# EAGLE design sms_gw (EAGLE 7.5.0)
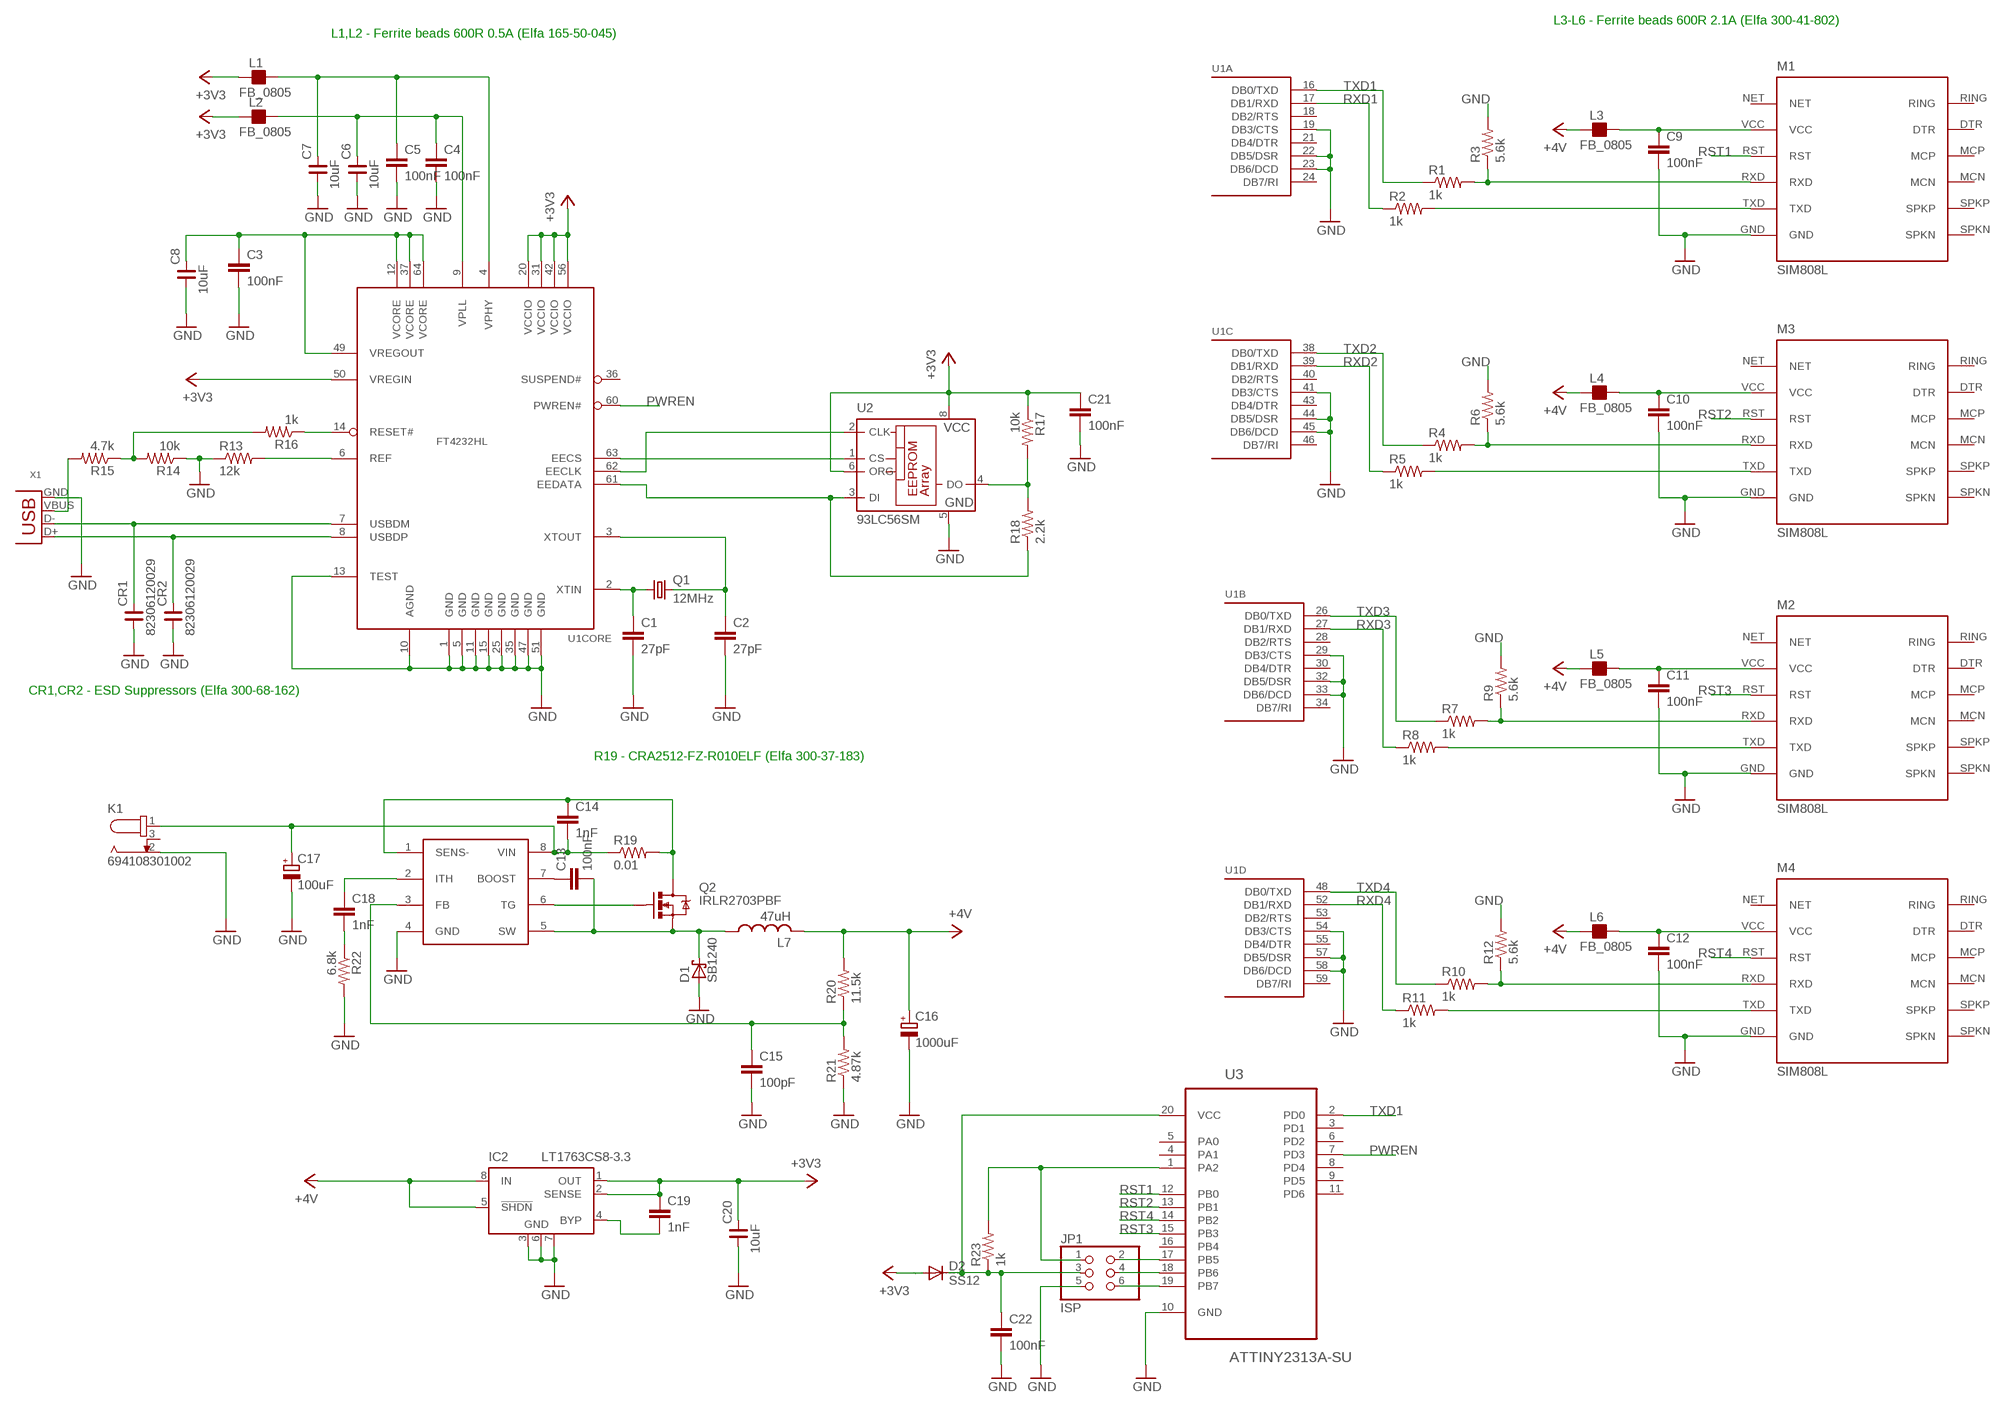
[diagram p0: schematic, sheet 1]

## Parts
C1  27pF  C-EUC0805  [C0805]
C2  27pF  C-EUC0805  [C0805]
C3  100nF  C-EUC0805  [C0805]
C4  100nF  C-EUC0805  [C0805]
C5  100nF  C-EUC0805  [C0805]
C6  10uF  C_1210  [C1210]
C7  10uF  C_1210  [C1210]
C8  10uF  C_1210  [C1210]
C9  100nF  C-EUC0805  [C0805]
C10  100nF  C-EUC0805  [C0805]
C11  100nF  C-EUC0805  [C0805]
C12  100nF  C-EUC0805  [C0805]
C13  100nF  C-EUC1206  [C1206]
C14  1nF  C-EUC0805  [C0805]
C15  100pF  C-EUC0805  [C0805]
C16  1000uF  CPOL-EUE5-8.5  [E5-8,5]
C17  100uF  CPOL-EUE5-8.5  [E5-8,5]
C18  1nF  C-EUC0805  [C0805]
C19  1nF  C-EUC0805  [C0805]
C20  10uF  C_1210  [C1210]
C21  100nF  C-EUC0805  [C0805]
C22  100nF  C-EUC0805  [C0805]
CR1  82306120029  C_0603  [C0603]
CR2  82306120029  C_0603  [C0603]
D1  SB1240  SCHOTTKY-DIODEF126Z12  [F126Z12]
D2  SS12  DIODE-DO-214AC  [DO-214AC]
IC1  LTC1624S8  [SO08]
IC2  LT1763CS8-3.3  [SOIC8]
JP1  ISP  PINHD-2X3  [2X03]
K1  694108301002  [694108301002]
L1  FB_0805  [L0805]
L2  FB_0805  [L0805]
L3  FB_0805  [L0805]
L4  FB_0805  [L0805]
L5  FB_0805  [L0805]
L6  FB_0805  [L0805]
L7  47uH  L-USTJ3-U2  [TJ3-U2]
M1  SIM808L  [SIM800L]
M2  SIM808L  [SIM800L]
M3  SIM808L  [SIM800L]
M4  SIM808L  [SIM800L]
Q1  12MHz  CRYSTALHC49U-V  [HC49U-V]
Q2  IRLR2703PBF  MOSFET-NCHANNELFDD8780  [DPAK]
R1  1k  R-US_R0805  [R0805]
R2  1k  R-US_R0805  [R0805]
R3  5.6k  R-US_R0805  [R0805]
R4  1k  R-US_R0805  [R0805]
R5  1k  R-US_R0805  [R0805]
R6  5.6k  R-US_R0805  [R0805]
R7  1k  R-US_R0805  [R0805]
R8  1k  R-US_R0805  [R0805]
R9  5.6k  R-US_R0805  [R0805]
R10  1k  R-US_R0805  [R0805]
R11  1k  R-US_R0805  [R0805]
R12  5.6k  R-US_R0805  [R0805]
R13  12k  R-US_R0805  [R0805]
R14  10k  R-US_R0805  [R0805]
R15  4.7k  R-US_R0805  [R0805]
R16  1k  R-US_R0805  [R0805]
R17  10k  R-US_R0805  [R0805]
R18  2.2k  R-US_R0805  [R0805]
R19  0.01  R-US_R2512  [R2512]
R20  11.5k  R-US_R0603  [R0603]
R21  4.87k  R-US_R0603  [R0603]
R22  6.8k  R-US_R0805  [R0805]
R23  1k  R-US_R0805  [R0805]
U1  FT4232HL  [LQFP64]
U2  93LC56SM  [SO-08M]
U3  ATTINY2313A-SU  [SOIC127P1032X265-20N]
X1  USB-B-H  [USB-B-H]

## Nets
+1V8: C3.1 C8.2 U1.12(CORE:VCORE) U1.37(CORE:VCORE) U1.49(CORE:VREGOUT) U1.64(CORE:VCORE)
+3V3: C19.1 C20.2 C21.1 D2.A IC2.1(OUT) IC2.2(SENSE) L1.1 L2.1 R17.1 U1.20(CORE:VCCIO) U1.31(CORE:VCCIO) U1.42(CORE:VCCIO) U1.50(CORE:VREGIN) U1.56(CORE:VCCIO) U2.6(ORG) U2.8(VCC)
+4V: C16.+ IC2.5(!SHDN) IC2.8(IN) L3.1 L4.1 L5.1 L6.1 L7.2 R20.2
GND: C1.2 C2.2 C3.2 C4.2 C5.2 C6.1 C7.1 C8.1 C9.2 C10.2 C11.2 C12.2 C15.2 C16.- C17.- C20.1 C21.2 C22.2 CR1.1 CR2.1 D1.A IC1.4(GND) IC2.3(GND) IC2.6(GND) IC2.7(GND) JP1.5 K1.2 M1.GND M2.GND M3.GND M4.GND R3.2 R6.2 R9.2 R12.2 R13.1 R14.1 R21.1 R22.2 U1.1(CORE:GND) U1.5(CORE:GND) U1.10(CORE:AGND) U1.11(CORE:GND) U1.13(CORE:TEST) U1.15(CORE:GND) U1.19(A:DB3/CTS) U1.22(A:DB5/DSR) U1.23(A:DB6/DCD) U1.25(CORE:GND) U1.29(B:DB3/CTS) U1.32(B:DB5/DSR) U1.33(B:DB6/DCD) U1.35(CORE:GND) U1.41(C:DB3/CTS) U1.44(C:DB5/DSR) U1.45(C:DB6/DCD) U1.47(CORE:GND) U1.51(CORE:GND) U1.54(D:DB3/CTS) U1.57(D:DB5/DSR) U1.58(D:DB6/DCD) U2.5(GND) U3.10(GND) X1.GND
N$1: M3.TXD R5.2
N$2: M1.TXD R2.2
N$5: M1.RXD R1.2 R3.1
N$7: JP1.2 U3.17(PB5)
N$8: M3.RXD R4.2 R6.1
N$9: M2.TXD R8.2
N$12: M2.RXD R7.2 R9.1
N$13: M4.TXD R11.2
N$14: C22.1 D2.C JP1.3 R23.1 U3.20(VCC)
N$16: M4.RXD R10.2 R12.1
N$17: C9.1 L3.2 M1.VCC
N$18: C1.1 Q1.1 U1.2(CORE:XTIN)
N$19: C2.1 Q1.2 U1.3(CORE:XTOUT)
N$20: R13.2 U1.6(CORE:REF)
N$21: CR1.2 U1.7(CORE:USBDM) X1.D-
N$22: CR2.2 U1.8(CORE:USBDP) X1.D+
N$23: C5.1 C7.2 L1.2 U1.4(CORE:VPHY)
N$24: C4.1 C6.2 L2.2 U1.9(CORE:VPLL)
N$25: R16.1 U1.14(CORE:RESET#)
N$26: R15.2 X1.VBUS
N$27: R14.2 R15.1 R16.2
N$28: C10.1 L4.2 M3.VCC
N$29: C11.1 L5.2 M2.VCC
N$30: C12.1 L6.2 M4.VCC
N$31: U1.63(CORE:EECS) U2.1(CS)
N$32: U1.62(CORE:EECLK) U2.2(CLK)
N$33: IC1.6(TG) Q2.1(G)
N$34: R17.2 R18.2 U2.4(DO)
N$35: R18.1 U1.61(CORE:EEDATA) U2.3(DI)
N$36: C13.2 D1.C IC1.5(SW) L7.1 Q2.3(S)
N$37: C13.1 IC1.7(BOOST)
N$38: C14.2 C17.+ IC1.8(VIN) K1.1 R19.1
N$39: C14.1 IC1.1(SENS-) Q2.4(D) R19.2
N$40: C15.1 IC1.3(FB) R20.1 R21.2
N$41: C18.1 IC1.2(ITH)
N$42: C18.2 R22.1
N$47: C19.2 IC2.4(BYP)
N$76: JP1.4 U3.18(PB6)
N$77: JP1.6 U3.19(PB7)
N$78: JP1.1 R23.2 U3.1(PA2)
PWREN: U1.60(CORE:PWREN#) U3.7(PD3)
RST1: M1.RST U3.12(PB0)
RST2: M3.RST U3.13(PB1)
RST3: M2.RST U3.15(PB3)
RST4: M4.RST U3.14(PB2)
RXD1: R2.1 U1.17(A:DB1/RXD)
RXD2: R5.1 U1.39(C:DB1/RXD)
RXD3: R8.1 U1.27(B:DB1/RXD)
RXD4: R11.1 U1.52(D:DB1/RXD)
TXD1: R1.1 U1.16(A:DB0/TXD) U3.2(PD0)
TXD2: R4.1 U1.38(C:DB0/TXD)
TXD3: R7.1 U1.26(B:DB0/TXD)
TXD4: R10.1 U1.48(D:DB0/TXD)
Unconnected: K1.3 M1.DTR M1.MCN M1.MCP M1.NET M1.RING M1.SPKN M1.SPKP M2.DTR M2.MCN M2.MCP M2.NET M2.RING M2.SPKN M2.SPKP M3.DTR M3.MCN M3.MCP M3.NET M3.RING M3.SPKN M3.SPKP M4.DTR M4.MCN M4.MCP M4.NET M4.RING M4.SPKN M4.SPKP U1.18(A:DB2/RTS) U1.21(A:DB4/DTR) U1.24(A:DB7/RI) U1.28(B:DB2/RTS) U1.30(B:DB4/DTR) U1.34(B:DB7/RI) U1.36(CORE:SUSPEND#) U1.40(C:DB2/RTS) U1.43(C:DB4/DTR) U1.46(C:DB7/RI) U1.53(D:DB2/RTS) U1.55(D:DB4/DTR) U1.59(D:DB7/RI) U2.7(NU) U3.3(PD1) U3.4(PA1) U3.5(PA0) U3.6(PD2) U3.8(PD4) U3.9(PD5) U3.11(PD6) U3.16(PB4)

## Notes on the sheet
- L3-L6 - Ferrite beads 600R 2.1A (Elfa 300-41-802)
- L1,L2 - Ferrite beads 600R 0.5A (Elfa 165-50-045)
- CR1,CR2 - ESD Suppressors (Elfa 300-68-162)
- R19 - CRA2512-FZ-R010ELF (Elfa 300-37-183)

## Library data of the parts
C1-C5 C9-C15 C18 C19 C21 C22 = rcl:C-EU: CAPACITOR, European symbol
C6-C8 C20 CR1 CR2 = rc-master-smd:C_: NON-POLARIZED CAP
C16 C17 = rcl:CPOL-EU: POLARIZED CAPACITOR, European symbol
D1 = diode:SCHOTTKY-DIODE: Schottky Diode
D2 = diode:DIODE-: DIODE
IC1 = linear-technology-3:LTC1624
IC2 = linear-technology:LT1763CS8: 500mA, Low Noise, LDO Micropower Regulators Source: http://cds.linear.com/docs/Datasheet/1763ff.pdf; MPN: LT1763CS8-3.3; OC_FARNELL: 1273617; OC_NEWARK: 57M6055
JP1 = pinhead:PINHD-2X3: PIN HEADER
K1 = Wurth_Elektronik_Electromechanic_DC_Power_Jack_Connectors_rev15c:694108301002: WR-DC_DC Power Jack_Right Angled_THT Center Pin Ø2.5_Plug ID Ø2.05_Plug OD Ø5.5 ;=>Code : Con_WR-DC_THT_694108301002_694108301002 <http://katalog.we-online.de/media/images/eican/Con_WR-DC_THT_694108301002_pf2.jpg> Details see: http://katalog.we-online.de/em/datasheet/6941xx301002.pdf Created 2014-10-08, Karrer Zheng 2014 (C) Wurth Elektronik
L1-L6 = rc-master-smd:FB_: FERRITE BEAD
L7 = rcl:L-US: INDUCTOR, American symbol
M1-M4 = simcom:SIM808L
Q1 = crystal:CRYSTAL: CRYSTAL; OC_FARNELL: 1666969; OC_NEWARK: unknown
Q2 = SparkFun-DiscreteSemi:MOSFET-NCHANNEL: Common NMOSFET Parts MFG P/N Store ID Prod ID FDD8780 TRANS-09984 SI7820DN TRANS-11055 FDS6630A IC-08089 2N7002PW TRANS-11151 FQP30N06L COM-10213 TRANS-10060 BSS123LT1G TRANS-08345 BSS138 TRANS-00830 BS170 2N7000; PROD_ID: TRANS-09984
R1-R23 = rcl:R-US_: RESISTOR, American symbol
U1 = ftdichip-6:FT4232H: Quad USB UART 5th generation USB to 4-port serial controller
U2 = microchip:93*: Serial EPROM 1 K/2 K/4 K, low voltage, Microwire; MF: MICROCHIP; MPN: 93LC56T/SN; OC_FARNELL: 9758240; OC_NEWARK: 92C7699
U3 = Atmel_By_element14_Batch_1-00:ATTINY2313A-SU: 8-bit Microcontroller with In-System Programmable Flash; MPN: ATTINY2313A-SU; OC_FARNELL: 1841617; OC_NEWARK: 12T1334; PACKAGE: SOIC-20; SUPPLIER: Atmel
X1 = con-usb-3:USB: USB Connectors

## Net classes
0 default: width 0.254 mm, clearance 0.254 mm

## Board
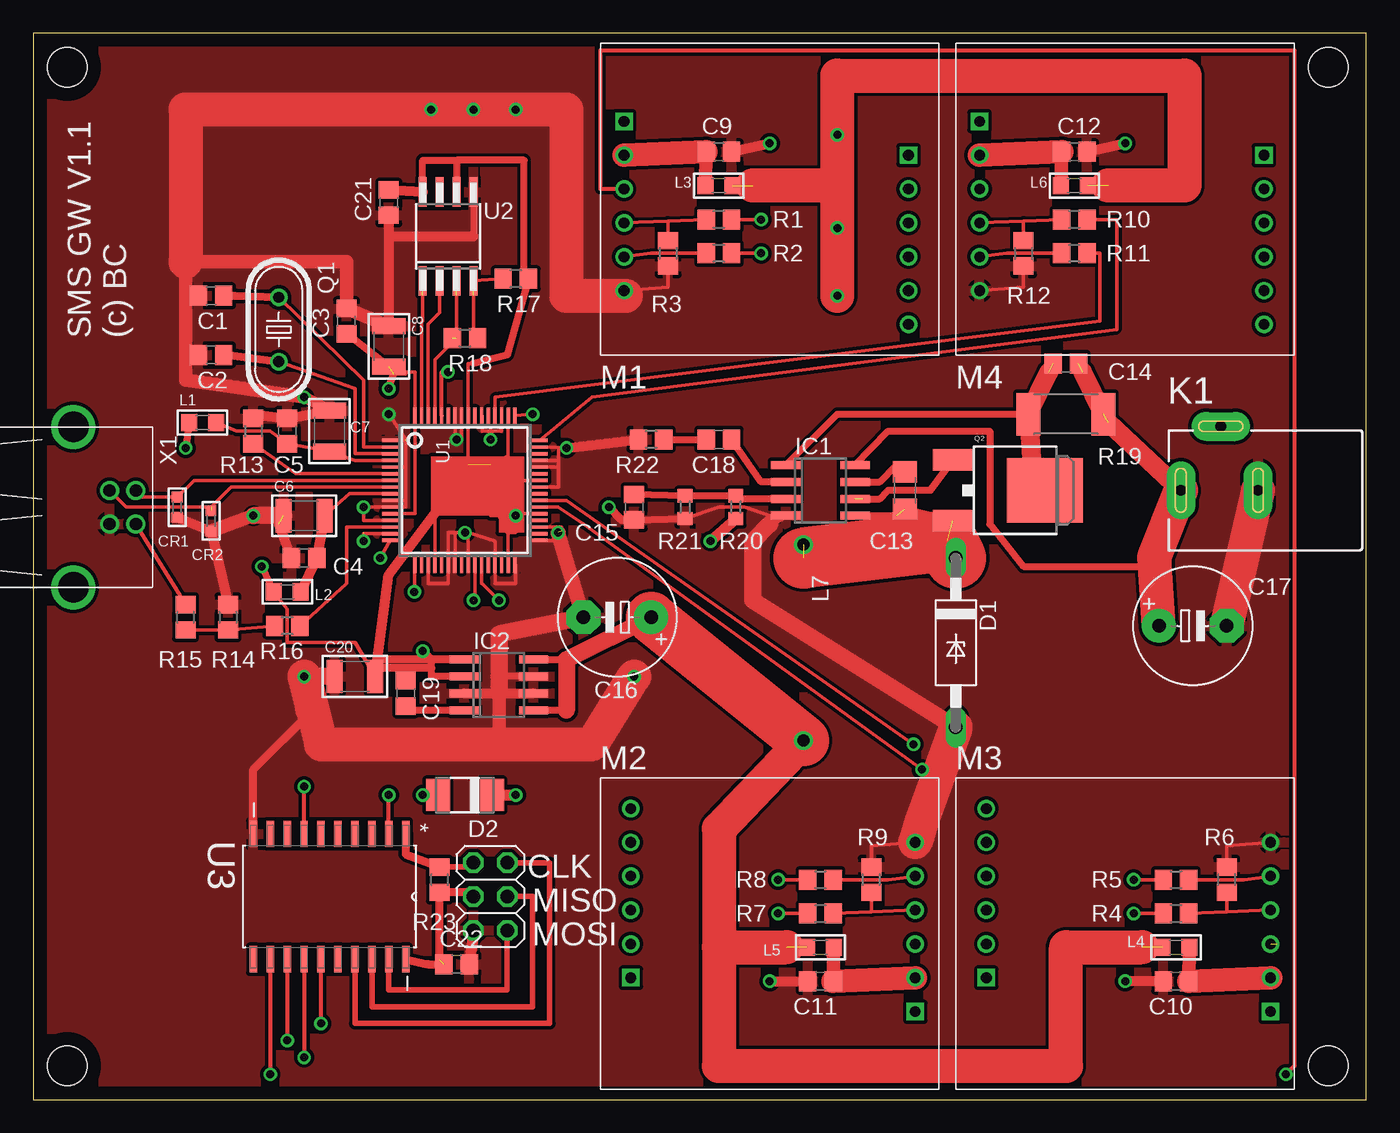
[diagram p1: board, top side]
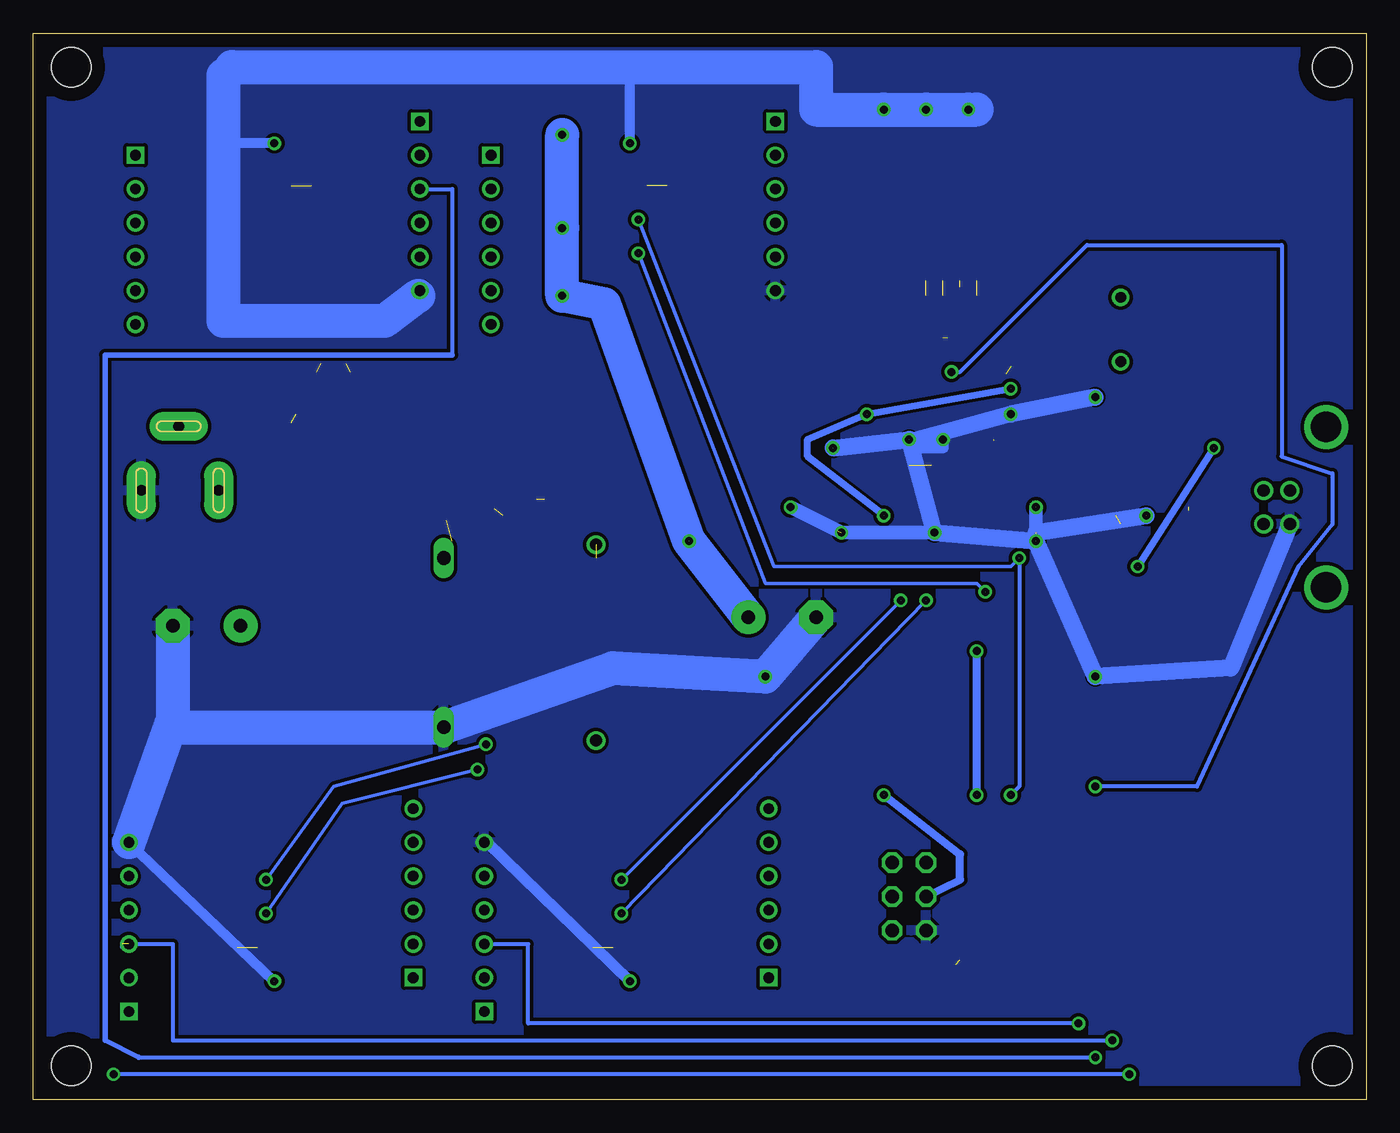
[diagram p2: board, bottom side, seen from below]

Size 100 x 80 mm. Coordinates in mm from the lower left corner, seen from the top.
Outline: 0,0 100,0 100,80 0,80 0,0
Copper layers (1*16): Top 0.035mm / dielectric 1.5mm / Bottom 0.035mm
Design rules "default": minimum track width 10mil, minimum drill 24mil, track to track 8mil, track to pad 8mil, pad to pad 8mil, via to via 8mil, smd to smd 8mil, copper to edge 40mil, drill to drill 8mil, minimum pad ring 10mil, minimum via ring 8mil, stop-mask expansion 4mil, vias tented up to drill 0mil, thermal gap 10mil
Holes 3 mm at 2.54,77.47 2.54,2.54 97.16,2.54 97.16,77.47

### Footprints (pad centres in the part's own frame; a part is rotated, then mirrored left to right if it is on the bottom)
C0805 = smd 1.3 x 1.5: 1 -0.95,0; 2 0.95,0
C1210 = smd 1.2 x 2.5: 1 -1.524,0; 2 1.524,0
C1206 = smd 1.6 x 1.8: 1 -1.4,0; 2 1.4,0
E5-8,5 = drill 1.016 pad 2.54: + -2.54,0 | drill 1.016 pad 2.54 octagon: - 2.54,0
C0603 = smd 0.8 x 0.8: 1 -0.762,0; 2 0.762,0
F126Z12 = drill 1.016 long: A 6.35,0; C -6.35,0
DO-214AC = smd 1.8 x 2.4: A 2.025,0; C -2.025,0
SO08 = smd 0.6 x 2.2: 1 -1.905,-2.6; 2 -0.635,-2.6; 3 0.635,-2.6; 4 1.905,-2.6; 5 1.905,2.6; 6 0.635,2.6; 7 -0.635,2.6; 8 -1.905,2.6
SOIC8 = smd 0.6 x 2.2: 1 -1.905,-2.6; 2 -0.635,-2.6; 3 0.635,-2.6; 4 1.905,-2.6; 5 1.905,2.6; 6 0.635,2.6; 7 -0.635,2.6; 8 -1.905,2.6
2X03 = drill 1.016 octagon: 1 -2.54,-1.27; 2 -2.54,1.27; 3 0,-1.27; 4 0,1.27; 5 2.54,-1.27; 6 2.54,1.27
694108301002 = drill 0.8 pad 2.184 long: 1 -13.6,0; 2 -7.8,0; 3 -10.6,4.8
L0805 = smd 1.2 x 1.3: 1 -1.016,0; 2 1.016,0
TJ3-U2 = drill 0.9: 1 -7.35,0; 2 7.35,0
SIM800L = drill 0.8: DTR 10.414,1.016; GND -10.922,-6.604; MCN 10.414,-4.064; MCP 10.414,-1.524; RST -10.922,1.016; RXD -10.922,-1.524; SPKN 10.414,-9.144; SPKP 10.414,-6.604; TXD -10.922,-4.064; VCC -10.922,3.556 | drill 0.8 square: NET -10.922,6.096; RING 10.414,3.556
HC49U-V = drill 0.813: 1 -2.413,0; 2 2.413,0
DPAK = smd 1.6 x 3: 1 -2.28,-5.31; 3 2.28,-5.31 | smd 4.826 x 5.715: 4 0,1.588
R0805 = smd 1.3 x 1.5: 1 -0.95,0; 2 0.95,0
R2512 = smd 1.8 x 3.2: 1 -2.8,0; 2 2.8,0
R0603 = smd 1 x 1.1: 1 -0.85,0; 2 0.85,0
LQFP64 = smd 0.25 x 1.2: 1 -3.75,-5.6; 2 -3.25,-5.6; 3 -2.75,-5.6; 4 -2.25,-5.6; 5 -1.75,-5.6; 6 -1.25,-5.6; 7 -0.75,-5.6; 8 -0.25,-5.6; 9 0.25,-5.6; 10 0.75,-5.6; 11 1.25,-5.6; 12 1.75,-5.6; 13 2.25,-5.6; 14 2.75,-5.6; 15 3.25,-5.6; 16 3.75,-5.6; 33 3.75,5.6; 34 3.25,5.6; 35 2.75,5.6; 36 2.25,5.6; 37 1.75,5.6; 38 1.25,5.6; 39 0.75,5.6; 40 0.25,5.6; 41 -0.25,5.6; 42 -0.75,5.6; 43 -1.25,5.6; 44 -1.75,5.6; 45 -2.25,5.6; 46 -2.75,5.6; 47 -3.25,5.6; 48 -3.75,5.6 | smd 1.2 x 0.25: 17 5.6,-3.75; 18 5.6,-3.25; 19 5.6,-2.75; 20 5.6,-2.25; 21 5.6,-1.75; 22 5.6,-1.25; 23 5.6,-0.75; 24 5.6,-0.25; 25 5.6,0.25; 26 5.6,0.75; 27 5.6,1.25; 28 5.6,1.75; 29 5.6,2.25; 30 5.6,2.75; 31 5.6,3.25; 32 5.6,3.75; 49 -5.6,3.75; 50 -5.6,3.25; 51 -5.6,2.75; 52 -5.6,2.25; 53 -5.6,1.75; 54 -5.6,1.25; 55 -5.6,0.75; 56 -5.6,0.25; 57 -5.6,-0.25; 58 -5.6,-0.75; 59 -5.6,-1.25; 60 -5.6,-1.75; 61 -5.6,-2.25; 62 -5.6,-2.75; 63 -5.6,-3.25; 64 -5.6,-3.75
SO-08M = smd 0.6 x 2.2: 1 -1.905,-3.33; 2 -0.635,-3.33; 3 0.635,-3.33; 4 1.905,-3.33; 5 1.905,3.33; 6 0.635,3.33; 7 -0.635,3.33; 8 -1.905,3.33
SOIC127P1032X265-20N = smd 1.981 x 0.559: 1 -4.699,5.715; 2 -4.699,4.445; 3 -4.699,3.175; 4 -4.699,1.905; 5 -4.699,0.635; 6 -4.699,-0.635; 7 -4.699,-1.905; 8 -4.699,-3.175; 9 -4.699,-4.445; 10 -4.699,-5.715; 11 4.699,-5.715; 12 4.699,-4.445; 13 4.699,-3.175; 14 4.699,-1.905; 15 4.699,-0.635; 16 4.699,0.635; 17 4.699,1.905; 18 4.699,3.175; 19 4.699,4.445; 20 4.699,5.715
USB-B-H = drill 0.914: D+ 0,1.25; D- 1.981,1.25; GND 0,-1.25; VBUS 1.981,-1.25 | drill 2.286: P$1 -2.718,-6.02; P$2 -2.718,6.02

### Placement (x,y rotation side)
C1  13.34,60.33 180 top
C2  13.34,55.88 180 top
C3  23.5,58.42 90 top
C4  20.32,40.64 180 top
C5  19.05,50.16 90 top
C6  20.32,43.81 0 top
C7  22.23,50.16 270 top
C8  26.67,56.52 270 top
C9  51.44,71.12 0 top
C10  85.72,8.89 180 top
C11  59.05,8.89 180 top
C12  78.11,71.12 0 top
C13  65.41,45.72 270 top
C14  77.47,55.24 0 top
C15  45.09,44.45 270 top
C16  43.81,36.2 180 top
C17  87,35.56 0 top
C18  51.44,49.53 180 top
C19  27.94,30.48 270 top
C20  24.13,31.75 0 top
C21  26.67,67.31 270 top
C22  31.75,10.16 0 top
CR1  10.79,44.45 90 top
CR2  13.34,43.43 90 top
D1  69.22,34.29 270 top
D2  32.38,22.86 180 top
IC1  59.05,45.72 270 top
IC2  34.92,31.11 270 top
JP1  34.29,15.24 270 top
K1  99.69,45.72 0 top
L1  12.7,50.8 0 top
L2  19.05,38.1 0 top
L3  51.44,68.58 180 top
L4  85.72,11.43 0 top
L5  59.05,11.43 0 top
L6  78.11,68.58 180 top
L7  57.78,34.29 270 top
M1  55.24,67.31 0 top
M2  55.24,12.7 180 top
M3  81.92,12.7 180 top
M4  81.92,67.31 0 top
Q1  18.41,57.78 270 top
Q2  74.3,45.72 270 top
R1  51.44,66.04 180 top
R2  51.44,63.5 180 top
R3  47.62,63.5 270 top
R4  85.72,13.97 0 top
R5  85.72,16.51 0 top
R6  89.53,16.51 90 top
R7  59.05,13.97 0 top
R8  59.05,16.51 0 top
R9  62.87,16.51 90 top
R10  78.11,66.04 180 top
R11  78.11,63.5 180 top
R12  74.3,63.5 270 top
R13  16.51,50.16 270 top
R14  14.61,36.2 270 top
R15  11.43,36.2 90 top
R16  19.05,35.56 180 top
R17  36.2,61.59 180 top
R18  32.38,57.15 0 top
R19  77.47,51.44 180 top
R20  52.7,44.45 270 top
R21  48.9,44.45 90 top
R22  46.35,49.53 180 top
R23  30.48,16.51 90 top
U1  32.38,45.72 270 top
U2  31.11,64.77 0 top
U3  22.23,15.24 270 top
X1  5.71,44.45 0 top

### Tracks (layer width: path | path; a pad name or v marks a point on that pad's centre or on a via)
+1V8  (4 unrouted)
  Top 0.254: U1.49 37.47,51.44 | U1.12 28.64,43.97 U1.64 28.64,54.61 27.94,54.61 27.94,54.43 27.03,54.43 | U1.37 36.2,43.97 36.2,43.81 | 36.2,43.81 36.2,42.55 35.56,42.55 35.56,43.81 36.2,43.81
  Top 0.508: C8.2 C3.1 | 26.67,53.34 27.03,54.43
  Bottom 0.508: 26.67,53.34 37.47,51.44 41.91,49.53 41.91,48.26 36.2,43.81
+3V3  (via drill 0.6)  (4 unrouted)
  Top 0.254: L2.1 19.05,36.83 19.05,34.29 24.13,34.29 C20.2 | 34.29,46.47 34.29,43.81 34.92,43.81 | 34.29,46.47 34.29,47.62 35.56,48.26 35.63,48.26 U1.50 | 34.92,43.81 35.56,42.55 35.63,42.55 U1.31 | 34.92,43.81 30.48,44.45 30.14,44.45 U1.20 | R17.1 36.83,61.91 | 33.02,55.24 32.63,55.24 U1.56 32.63,47.62 32.38,47.62 | U1.42 34.29,46.47 | 27.94,31.75 C19.1
  Top 0.406: 25.84,33.02 25.84,33.13 | 26.04,32.38 26.04,33.02 | 27.94,32.38 C19.1
  Top 0.508: L1.1 11.43,48.9 | 17.14,40.01 L2.1 | R17.1 35.56,55.88 33.02,55.24 | U2.8 29.21,70.48 31.75,70.48 | 31.75,70.48 U2.6 | 36.83,61.91 36.83,70.48 31.75,70.48 | IC2.2 29.84,31.75 29.84,32.38 29.84,33.02
  Top 0.61: IC2.1 29.84,33.02 | 29.84,33.02 26.04,33.02 25.84,33.02 | 29.84,32.38 27.94,32.38 26.04,32.38 | D2.A 29.21,22.86 | 29.84,33.02 v29.21,33.66
  Top 0.762: C20.2 25.84,33.13 26.67,39.37 30.48,44.45 | U2.8 C21.1
  Bottom 0.508: 11.43,48.9 17.14,40.01
  Bottom 0.61: 29.21,22.86 v29.21,33.66
+4V  (via drill 0.6)  (5 unrouted)
  Top 0.508: IC2.8 40.01,33.02 | 40.01,29.21 IC2.5
  Top 0.813: 50.8,41.91 R20.2
  Top 1.27: 40.01,29.21 40.01,33.02 C16.+
  Top 2.54: L7.2 51.44,20.32 51.44,11.43 | 51.44,11.43 51.44,2.54 77.47,2.54 77.47,11.43 83.19,11.43 | 51.44,11.43 56.52,11.43 | v60.33,60.33 60.33,68.58 | 60.33,68.58 53.98,68.58 | 60.33,68.58 60.33,76.83 86.36,76.83 86.36,68.58 80.64,68.58
  Top 3.81: L7.2 C16.+
  Bottom 2.54: C16.+ 50.8,41.91 57.15,59.69 v60.33,60.33 v60.33,65.41 v60.33,72.39
GND  (via drill 0.6)  (12 unrouted)
  Top 0.254: M4.GND 74.3,60.96 R12.2 | M1.GND 47.62,60.96 R3.2 | M2.GND 62.87,19.05 R9.2 | M3.GND 89.53,19.05 R6.2 | R21.1 51.44,44.45 53.34,44.45 55.24,43.81 | R13.1 16.51,51.44 | U1.47 39.39,48.92 | 39.39,48.92 40.01,48.9 | U1.41 39.39,45.97 39.39,47.47 | 39.39,47.97 39.39,48.92 | U1.44 39.39,47.47 | U1.45 39.39,47.97 | 39.39,47.97 39.39,47.47 | U1.54 33.66,51.32 33.66,50.16 34.29,50.16 35.13,50.16 U1.51 | U1.57 32.13,49.53 v31.75,49.53 31.64,49.53 U1.58 | U1.25 32.63,42.55 | U1.23 31.64,42.55 | 31.64,42.55 32.63,42.55 | 31.64,42.55 31.14,42.55 U1.22 31.11,40.12 31.11,38.73 29.64,38.73 U1.19 | 32.63,42.55 34.63,41.91 U1.29 34.63,38.73 36.2,38.73 36.2,40.12 U1.32 | U1.35 39.62,42.97 39.62,42.67 | U1.15 24.77,42.47 24.77,41.91 | U1.13 24.77,43.47 24.77,44.47 U1.11 27.94,44.47 | U1.5 27.94,47.47 | 27.94,47.47 27.94,49.47 U1.1 26.67,49.47 | 27.94,44.47 27.94,44.45 | U1.10 27.94,44.97 27.94,44.47 | U1.33 39.37,41.97 39.37,42.55 | 27.94,45.09 27.94,47.47
  Top 0.305: v26.67,51.44 27.94,49.53
  Top 0.406: 34.29,50.16 34.29,49.53
  Top 0.508: C15.2 R21.1 | 55.24,43.18 IC1.4 | U2.5 33.02,64.77 | IC2.7 34.92,31.75
  Top 0.61: C15.2 44.13,43.5 43.18,44.45 | U3.10 16.51,24.77 20.92,29.17 20.92,29.36
  Top 0.762: IC2.3 34.92,30.48 IC2.6 | 16.51,51.44 C5.2 C7.1 | C4.2 18.41,43.18 | R14.1 CR2.1 CR1.1 | 33.02,64.77 26.67,64.77 | 26.67,64.77 C8.1 | 40.01,48.9 R22.2 | C12.2 81.92,71.75 | C9.2 55.24,71.75 | C10.2 81.92,8.89 | 55.24,8.89 C11.2 | C21.2 26.67,64.77
  Top 0.813: C7.1 20.32,52.7 | JP1.5 C22.2
  Top 1.016: 16.51,43.81 CR2.1 | C8.1 C3.2 23.5,62.87 11.43,62.87 11.43,53.98 20.32,52.7 | 34.92,31.11 34.92,27.3
  Top 1.143: C16.- 39.37,42.55
  Top 1.27: C16.- 34.92,34.92 34.92,31.75 34.92,31.11 34.92,30.48 | D1.A 53.98,37.47 53.98,41.91 55.24,43.18 | C6.1 16.51,43.81 | C20.1 20.32,31.75
  Top 2.54: C17.- K1.2 | D1.A 66.67,20.95 M2.GND | 11.43,62.87 11.43,74.3 v29.84,74.3 v33.02,74.3 v36.2,74.3 40.01,74.3 40.01,60.33 44.45,60.33 | 20.32,31.75 20.92,29.36 21.59,26.67 41.91,26.67 v45.09,31.75
  Bottom 0.254: 34.25,49.37 34.29,49.53 | 31.88,50.01 31.88,49.53 v31.75,49.53 34.29,49.53 | 34.29,48.9 34.29,49.53
  Bottom 0.762: 85.72,76.83 85.09,77.47 | 81.92,71.75 85.72,71.75 | 55.24,71.75 55.24,77.47 | 81.92,8.89 M3.GND
  Bottom 0.813: 66.04,19.36 55.24,8.89 | v31.75,49.53 31.75,48.9 34.29,48.9
  Bottom 1.016: 32.38,42.55 39.37,42.55 43.18,44.45 | 24.77,44.45 24.77,41.91
  Bottom 1.27: 20.32,52.7 v26.67,51.44 31.88,50.01 34.25,49.37 32.38,42.55 24.77,41.91 20.32,31.75 10.16,32.38 X1.GND | 40.01,48.9 34.29,49.53 | 24.77,42.55 16.51,43.81
  Bottom 2.54: M3.GND 89.53,28.57 C17.- 89.53,27.94 D1.A 56.52,32.38 v45.09,31.75 C16.- | 71.12,60.33 73.66,58.42 85.72,58.42 85.72,76.83 | 85.09,77.47 41.27,77.47 41.27,74.3 v36.2,74.3 v33.02,74.3 v29.84,74.3 29.21,74.3
  pour Top: 0,80.01 0,0 100.33,0 100.33,80.01
  pour Bottom: 0,80.01 0,0 100.33,0 100.33,80.01
N$1
  Top 0.254: M3.TXD 90.81,16.51 R5.2
N$2
  Top 0.254: M1.TXD 46.35,63.5 R2.2
N$3  (via drill 0.6)
  other vias: 20.32,3.17
N$4  (via drill 0.6)
  other vias: 26.67,22.86
N$5
  Top 0.254: M1.RXD 47.6,65.92 | 47.6,65.92 R1.2 | R3.1 47.6,65.92
N$6  (via drill 0.6)
  other vias: 33.02,37.47
N$7
  Top 0.406: U3.17 24.13,5.71 38.73,5.71 38.73,17.78 JP1.2
N$8
  Top 0.254: M3.RXD 89.56,14.09 | 89.56,14.09 R4.2 | R6.1 89.56,14.09
N$9
  Top 0.254: M2.TXD 64.14,16.51 R8.2
N$10  (via drill 0.6)
  other vias: 34.92,37.47
N$12
  Top 0.254: M2.RXD 62.89,14.09 | 62.89,14.09 R7.2 | R9.1 62.89,14.09
N$13
  Top 0.254: M4.TXD 73.03,63.5 R11.2
N$14  (2 unrouted)
  Top 0.61: U3.20 29.59,10.16 C22.1 | JP1.3 32.7,15.56 R23.1 30.48,10.48
  Top 0.813: D2.C 36.2,22.86
  Bottom 0.61: JP1.3 30.48,16.51 30.48,18.41 36.2,22.86
N$15  (via drill 0.6)
  other vias: 29.21,22.86
N$16
  Top 0.254: M4.RXD 74.3,65.92 | 74.3,65.92 R10.2 | R12.1 74.3,65.92
N$17
  Top 1.016: 50.16,71.12 C9.1 L3.2
  Top 1.778: M1.VCC C9.1
N$18
  Top 0.254: U1.2 24.77,48.97 24.77,53.98 Q1.1
  Top 0.61: C1.1 15.11,60.33 Q1.1
N$19
  Top 0.254: U1.3 24.13,48.47 24.13,53.34 Q1.2
  Top 0.61: C2.1 14.73,55.88 Q1.2
N$20
  Top 0.254: U1.6 19.68,46.99 R13.2
N$21
  Top 0.254: U1.7 12.05,46.47 CR1.2 8.18,45.21 X1.D-
N$22  (1 unrouted)
  Top 0.254: U1.8 14.86,45.97 13.34,44.45 6.96,44.45 X1.D+
N$23
  Top 0.254: C7.2 C5.1 17.78,50.16 15.24,50.16 L1.2 | U1.4 24.13,47.97 C7.2 | 22.23,48.26 C7.2
N$24
  Top 0.254: U1.9 23.75,45.47 C6.2
  Top 0.762: C6.2 C4.1 L2.2
N$25
  Top 0.254: R16.1 23.5,38.73 23.5,42.97 U1.14
N$26
  Top 0.305: X1.VBUS R15.2
N$27
  Top 0.254: R15.1 R14.2 R16.2
N$28
  Top 1.016: L4.2 C10.1
  Top 1.778: M3.VCC C10.1
N$29
  Top 1.016: L5.2 C11.1
  Top 1.778: M2.VCC C11.1
N$30
  Top 1.016: C12.1 L6.2
  Top 1.778: M4.VCC C12.1
N$31  (1 unrouted)
  Top 0.254: U1.63 29.14,58.34 29.21,58.42 29.21,60.33
N$32  (1 unrouted)
  Top 0.254: U1.62 29.64,58.21 30.48,59.05 30.48,60.96
N$33  (1 unrouted)
  Top 0.508: Q2.1 67.31,45.72 64.14,45.72 63.5,45.09 62.23,45.09
N$34  (1 unrouted)
  Top 0.254: R18.2 33.02,57.47 33.02,60.33 | U2.4 R17.2
N$35  (2 unrouted)
  Top 0.254: U1.61 30.14,55.53 31.75,57.15 31.75,60.33
N$36  (3 unrouted)
  Top 0.508: IC1.5 64.77,43.81 | C13.2 Q2.3
  Top 4.572: D1.C 68.58,41.91 57.78,40.64
N$37
  Top 0.254: 64.77,47.62 64.9,47.62 C13.1
  Top 0.508: IC1.7 63.5,46.35 64.77,47.62
N$38  (2 unrouted)
  Top 0.508: IC1.8 64.14,50.16 71.75,50.16 71.75,43.18 74.3,40.01 83.19,40.01 84.09,40.7
  Top 1.422: R19.1 78.74,54.61 | K1.1 80.64,50.8
  Top 2.54: C17.+ 84.09,40.7 K1.1
N$39  (1 unrouted)
  Top 0.508: IC1.1 60.33,51.44 R19.2 | 74.93,47.62 Q2.4
  Top 1.422: 74.93,47.62 R19.2 76.2,54.61
N$40
  Top 0.254: 52.92,45.09 R20.1
  Top 0.508: R20.1 R21.2 C15.1 | IC1.3 52.92,45.09
N$41
  Top 0.508: IC1.2 54.61,46.35 C18.1
N$42
  Top 0.508: R22.1 C18.2
N$43  (via drill 0.6)
  other vias: 36.2,22.86
N$44  (via drill 0.6)
  other vias: 50.8,41.91
N$46  (via drill 0.6)
  other vias: 55.88,16.51
N$47
  Top 0.254: 27.94,29.21 C19.2
  Top 0.508: IC2.4 27.94,29.21
N$48  (via drill 0.6)
  other vias: 55.88,13.97
N$49  (via drill 0.6)
  other vias: 82.55,16.51
N$50  (via drill 0.6)
  other vias: 82.55,13.97
N$51  (via drill 0.6)
  other vias: 28.57,38.1
N$52  (via drill 0.6)
  other vias: 26.04,40.64
N$53  (via drill 0.6)
  other vias: 54.61,63.5
N$54  (via drill 0.6)
  other vias: 54.61,66.04
N$55  (via drill 0.6)
  other vias: 11.43,48.9
N$56  (via drill 0.6)
  other vias: 17.14,40.01
N$57  (via drill 0.6)
  other vias: 24.77,41.91
N$58  (via drill 0.6)
  other vias: 32.38,42.55
N$59  (via drill 0.6)
  other vias: 36.2,43.81
N$60  (via drill 0.6)
  other vias: 40.01,48.9
N$61  (via drill 0.6)
  other vias: 34.29,49.53
N$63  (via drill 0.6)
  other vias: 20.32,52.7
N$64  (via drill 0.6)
  other vias: 39.37,42.55
N$65  (via drill 0.6)
  other vias: 37.47,51.44
N$66  (via drill 0.6)
  other vias: 26.67,53.34
N$67  (via drill 0.6)
  other vias: 24.77,44.45
N$68  (via drill 0.6)
  other vias: 16.51,43.81
N$69  (via drill 0.6)
  other vias: 20.32,31.75
N$70  (via drill 0.6)
  other vias: 43.18,44.45
N$71  (via drill 0.6)
  other vias: 81.92,71.75
N$72  (via drill 0.6)
  other vias: 55.24,71.75
N$73  (via drill 0.6)
  other vias: 55.24,8.89
N$74  (via drill 0.6)
  other vias: 81.92,8.89
N$76
  Top 0.406: U3.18 25.4,6.99 37.47,6.99 37.47,15.24 JP1.4
N$77
  Top 0.406: JP1.6 35.56,8.26 26.67,8.26 U3.19
N$78
  Top 0.406: JP1.1 32.7,17.46 R23.2
  Top 0.61: U3.1 27.94,18.41 R23.2
PWREN  (via drill 0.6)
  Top 0.305: U1.60 30.64,54.61 v31.11,54.61 | U3.7 v20.32,23.5
  Bottom 0.305: v31.11,54.61 30.48,54.61 20.95,64.14 6.35,64.14 6.35,48.26 2.54,46.99 2.54,43.18 5.08,40.01 12.7,23.5 v20.32,23.5
RST1  (via drill 0.6)
  Top 0.305: M1.RST 42.55,68.33 42.55,78.74 94.61,78.74 94.61,2.54 v93.98,1.91 | U3.12 v17.78,1.91
  Bottom 0.305: v17.78,1.91 v93.98,1.91
RST2  (via drill 0.6)  (1 unrouted)
  Top 0.305: U3.13 v19.05,4.45
  Bottom 0.305: 93.34,11.68 93.34,11.43 | v19.05,4.45 89.53,4.45 89.53,11.68 M3.RST
RST3  (via drill 0.6)
  Top 0.305: v21.59,5.71 U3.15
  Bottom 0.305: v21.59,5.71 62.87,5.71 62.87,11.68 M2.RST
RST4  (1 unrouted)
  Top 0.305: U3.14 20.32,3.17
  Bottom 0.305: M4.RST 68.58,68.33 68.58,55.88 | 92.08,3.17 20.32,3.17
  Bottom 0.406: 68.58,55.88 94.61,55.88 94.61,4.45 92.08,3.17
RXD1  (2 unrouted)
  Top 0.254: U1.17 28.57,38.1 | R2.1 54.61,63.5
  Bottom 0.254: 54.61,63.5 45.09,38.73 29.21,38.73 28.57,38.1
RXD2  (via drill 0.6)  (1 unrouted)
  Top 0.254: R5.1 82.55,16.51 | U1.39 40.01,44.97 v66.04,26.67
  Bottom 0.254: v66.04,26.67 77.47,23.5 82.55,16.51
RXD3  (2 unrouted)
  Top 0.254: R8.1 55.88,16.51 | 34.92,37.47 33.66,38.73 33.63,38.73 U1.27
  Bottom 0.254: 55.88,16.51 34.92,37.47
RXD4
  Top 0.254: U1.52 34.63,52.7 80.01,58.42 80.01,63.5 R11.1
TXD1  (3 unrouted)
  Top 0.254: U1.16 26.04,40.64 | R1.1 54.61,66.04
  Top 0.305: U3.2 26.67,22.86
  Bottom 0.254: 54.61,66.04 44.45,40.01 26.67,40.01 26.04,40.64
  Bottom 0.305: 26.04,40.64 26.04,23.5 26.67,22.86
TXD2  (via drill 0.6)  (1 unrouted)
  Top 0.254: v66.67,24.77 41.27,43.18 39.37,44.45 39.37,44.47 U1.38 | R4.1 82.55,13.97
  Bottom 0.254: v66.67,24.77 76.83,22.23 82.55,13.97
TXD3  (2 unrouted)
  Top 0.254: R7.1 55.88,13.97 | U1.26 33.13,37.47 33.02,37.47
  Bottom 0.254: 55.88,13.97 33.02,37.47
TXD4
  Top 0.254: R10.1 81.28,66.04 81.28,57.78 41.91,52.7 U1.48
(copper drawn outside any net)
  shapes: Top area x2

### Text on the board
tNames: SMS GW V1.1 / (c) BC | M1 | M4 | M2 | M3 | CLK | MISO | MOSI